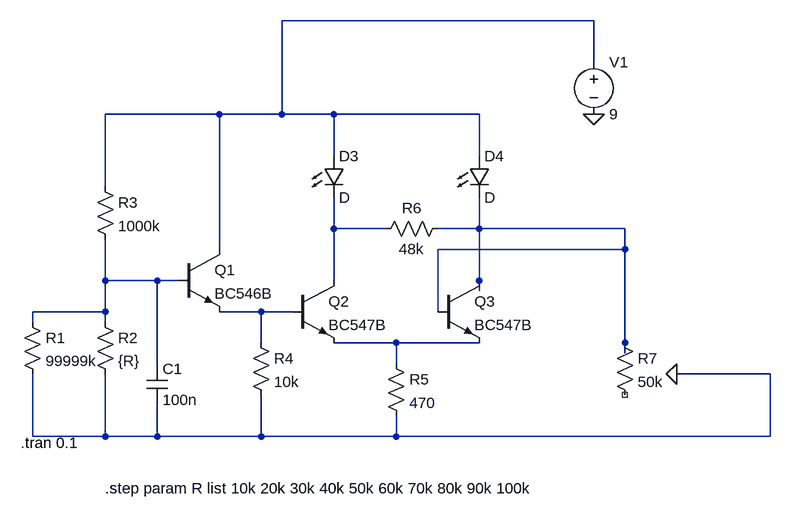
[diagram p0: schematic Draft1.asc]
Draft1.asc, the LTspice schematic file:
Version 4
SHEET 1 1012 680
WIRE 736 -224 256 -224
WIRE 736 -160 736 -224
WIRE 160 -80 -16 -80
WIRE 256 -80 256 -224
WIRE 256 -80 160 -80
WIRE 336 -80 256 -80
WIRE 560 -80 336 -80
WIRE 336 -16 336 -80
WIRE 560 -16 560 -80
WIRE -16 32 -16 -80
WIRE 336 96 336 48
WIRE 416 96 336 96
WIRE 560 96 560 48
WIRE 560 96 496 96
WIRE 784 96 560 96
WIRE 160 128 160 -80
WIRE 784 128 784 96
WIRE 784 128 496 128
WIRE -16 176 -16 112
WIRE 64 176 -16 176
WIRE 96 176 64 176
WIRE 336 176 336 96
WIRE 560 176 560 96
WIRE 560 192 560 176
WIRE -16 224 -16 176
WIRE -16 224 -128 224
WIRE 224 224 160 224
WIRE 272 224 224 224
WIRE 496 224 496 128
WIRE -128 240 -128 224
WIRE -16 240 -16 224
WIRE 224 272 224 224
WIRE 432 272 336 272
WIRE 560 272 432 272
WIRE 784 272 784 128
WIRE 784 288 784 272
WIRE 64 304 64 176
WIRE 432 304 432 272
WIRE 1008 320 864 320
WIRE -128 416 -128 320
WIRE -16 416 -16 320
WIRE -16 416 -128 416
WIRE 64 416 64 368
WIRE 64 416 -16 416
WIRE 224 416 224 352
WIRE 224 416 64 416
WIRE 432 416 432 384
WIRE 432 416 224 416
WIRE 1008 416 1008 320
WIRE 1008 416 432 416
FLAG 736 -80 0
FLAG 864 320 0
SYMBOL res -144 224 R0
SYMATTR InstName R1
SYMATTR Value 99999k
SYMBOL res -32 224 R0
SYMATTR InstName R2
SYMATTR Value {R}
SYMBOL npn 96 128 R0
SYMATTR InstName Q1
SYMATTR Value BC546B
SYMBOL npn 272 176 R0
SYMATTR InstName Q2
SYMATTR Value BC547B
SYMBOL LED 320 -16 R0
SYMATTR InstName D3
SYMBOL LED 544 -16 R0
SYMATTR InstName D4
SYMBOL res -32 16 R0
SYMATTR InstName R3
SYMATTR Value 1000k
SYMBOL cap 48 304 R0
SYMATTR InstName C1
SYMATTR Value 100n
SYMBOL res 208 256 R0
SYMATTR InstName R4
SYMATTR Value 10k
SYMBOL res 416 288 R0
SYMATTR InstName R5
SYMATTR Value 470
SYMBOL npn 496 176 R0
SYMATTR InstName Q3
SYMATTR Value BC547B
SYMBOL res 512 80 R90
WINDOW 0 0 56 VBottom 2
WINDOW 3 32 56 VTop 2
SYMATTR InstName R6
SYMATTR Value 48k
SYMBOL res 768 256 R0
SYMATTR InstName R7
SYMATTR Value 50k
SYMBOL voltage 736 -176 R0
WINDOW 123 0 0 Left 0
WINDOW 39 0 0 Left 0
SYMATTR InstName V1
SYMATTR Value 9
TEXT -146 426 Left 2 !.tran 0.1
TEXT -16 496 Left 2 !.step param R list 10k 20k 30k 40k 50k 60k 70k 80k 90k 100k

The netlist it stands for:
* Draft1.asc
R1 N004 0 99999k
R2 N004 0 {R}
Q1 N001 N004 N005 0 BC546B
Q2 N002 N005 N006 0 BC547B
D3 N001 N002 D
D4 N001 N003 D
R3 N001 N004 1000k
C1 N004 0 100n
R4 N005 0 10k
R5 N006 0 470
Q3 N003 N003 N006 0 BC547B
R6 N003 N002 48k
R7 N003 NC_01 50k
V1 N001 0 9
.model D D
.lib standard.dio
.model NPN NPN
.model PNP PNP
.lib standard.bjt
.tran 0.1
.step param R list 10k 20k 30k 40k 50k 60k 70k 80k 90k 100k
.backanno
.end